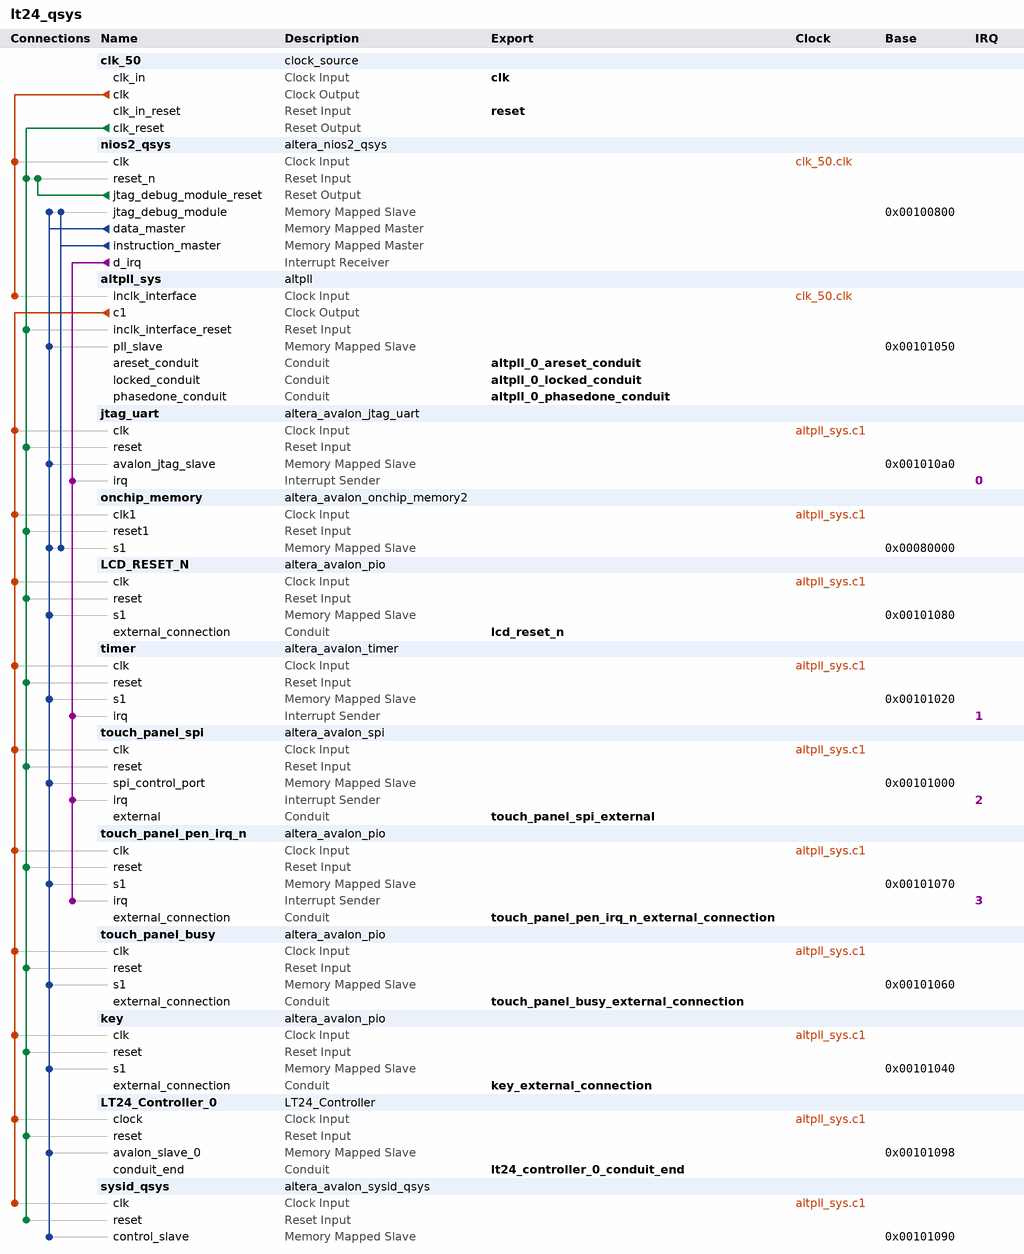
[diagram p0: system contents]
# Platform Designer (Qsys) system lt24_qsys, Cyclone IV E EP4CE115F29C7
# Parameters at their usual value, and those the tool derives, are not listed.
package require -exact qsys 13.1
create_system lt24_qsys
set_project_property DEVICE_FAMILY {Cyclone IV E}
set_project_property DEVICE EP4CE115F29C7

add_instance clk_50 clock_source 13.1
set_instance_parameter_value clk_50 clockFrequency 50000000

add_instance nios2_qsys altera_nios2_qsys 13.1
set_instance_parameter_value nios2_qsys resetSlave onchip_memory.s1
set_instance_parameter_value nios2_qsys exceptionSlave onchip_memory.s1
set_instance_parameter_value nios2_qsys breakSlave nios2_qsys.jtag_debug_module
set_instance_parameter_value nios2_qsys impl Fast
set_instance_parameter_value nios2_qsys icache_size 4096

add_instance altpll_sys altpll 13.1
set_instance_parameter_value altpll_sys INCLK0_INPUT_FREQUENCY 20000
set_instance_parameter_value altpll_sys CLK0_MULTIPLY_BY 2
set_instance_parameter_value altpll_sys CLK1_MULTIPLY_BY 3
set_instance_parameter_value altpll_sys CLK0_DIVIDE_BY 1
set_instance_parameter_value altpll_sys CLK1_DIVIDE_BY 1
set_instance_parameter_value altpll_sys CLK1_PHASE_SHIFT 0
set_instance_parameter_value altpll_sys CLK1_DUTY_CYCLE 50
set_instance_parameter_value altpll_sys PORT_clk1 PORT_USED
set_instance_parameter_value altpll_sys PORT_clk2 PORT_UNUSED
set_instance_parameter_value altpll_sys PORT_clk3 PORT_UNUSED
set_instance_parameter_value altpll_sys PORT_ARESET PORT_UNUSED
set_instance_parameter_value altpll_sys PORT_LOCKED PORT_UNUSED

add_instance jtag_uart altera_avalon_jtag_uart 13.1
set_instance_parameter_value jtag_uart simInteractiveOptions INTERACTIVE_ASCII_OUTPUT

add_instance onchip_memory altera_avalon_onchip_memory2 13.1
set_instance_parameter_value onchip_memory dataWidth 32
set_instance_parameter_value onchip_memory dualPort false
set_instance_parameter_value onchip_memory initMemContent true
set_instance_parameter_value onchip_memory initializationFileName onchip_memory
set_instance_parameter_value onchip_memory memorySize 280000

add_instance LCD_RESET_N altera_avalon_pio 13.1
set_instance_parameter_value LCD_RESET_N direction Output
set_instance_parameter_value LCD_RESET_N width 1

add_instance timer altera_avalon_timer 13.1
set_instance_parameter_value timer period 1
set_instance_parameter_value timer periodUnits MSEC

add_instance touch_panel_spi altera_avalon_spi 13.1
set_instance_parameter_value touch_panel_spi clockPolarity 0
set_instance_parameter_value touch_panel_spi dataWidth 8
set_instance_parameter_value touch_panel_spi masterSPI true
set_instance_parameter_value touch_panel_spi numberOfSlaves 1
set_instance_parameter_value touch_panel_spi targetClockRate 32000

add_instance touch_panel_pen_irq_n altera_avalon_pio 13.1
set_instance_parameter_value touch_panel_pen_irq_n captureEdge true
set_instance_parameter_value touch_panel_pen_irq_n direction Input
set_instance_parameter_value touch_panel_pen_irq_n edgeType FALLING
set_instance_parameter_value touch_panel_pen_irq_n generateIRQ true
set_instance_parameter_value touch_panel_pen_irq_n irqType EDGE
set_instance_parameter_value touch_panel_pen_irq_n width 1

add_instance touch_panel_busy altera_avalon_pio 13.1
set_instance_parameter_value touch_panel_busy direction Input
set_instance_parameter_value touch_panel_busy width 1

add_instance key altera_avalon_pio 13.1
set_instance_parameter_value key direction Input
set_instance_parameter_value key width 4

add_instance LT24_Controller_0 LT24_Controller 1.0

add_instance sysid_qsys altera_avalon_sysid_qsys 13.1
set_instance_parameter_value sysid_qsys id 0

# connections
add_connection altpll_sys.c1 jtag_uart.clk clock
add_connection altpll_sys.c1 key.clk clock
add_connection altpll_sys.c1 LCD_RESET_N.clk clock
add_connection altpll_sys.c1 LT24_Controller_0.clock clock
add_connection altpll_sys.c1 onchip_memory.clk1 clock
add_connection altpll_sys.c1 sysid_qsys.clk clock
add_connection altpll_sys.c1 timer.clk clock
add_connection altpll_sys.c1 touch_panel_busy.clk clock
add_connection altpll_sys.c1 touch_panel_pen_irq_n.clk clock
add_connection altpll_sys.c1 touch_panel_spi.clk clock
add_connection clk_50.clk altpll_sys.inclk_interface clock
add_connection clk_50.clk nios2_qsys.clk clock
add_connection clk_50.clk_reset altpll_sys.inclk_interface_reset reset
add_connection clk_50.clk_reset jtag_uart.reset reset
add_connection clk_50.clk_reset key.reset reset
add_connection clk_50.clk_reset LCD_RESET_N.reset reset
add_connection clk_50.clk_reset LT24_Controller_0.reset reset
add_connection clk_50.clk_reset nios2_qsys.reset_n reset
add_connection clk_50.clk_reset onchip_memory.reset1 reset
add_connection clk_50.clk_reset sysid_qsys.reset reset
add_connection clk_50.clk_reset timer.reset reset
add_connection clk_50.clk_reset touch_panel_busy.reset reset
add_connection clk_50.clk_reset touch_panel_pen_irq_n.reset reset
add_connection clk_50.clk_reset touch_panel_spi.reset reset
add_connection nios2_qsys.jtag_debug_module_reset nios2_qsys.reset_n reset
add_connection nios2_qsys.data_master altpll_sys.pll_slave avalon
set_connection_parameter_value nios2_qsys.data_master/altpll_sys.pll_slave baseAddress 0x00101050
add_connection nios2_qsys.data_master jtag_uart.avalon_jtag_slave avalon
set_connection_parameter_value nios2_qsys.data_master/jtag_uart.avalon_jtag_slave baseAddress 0x001010a0
add_connection nios2_qsys.data_master key.s1 avalon
set_connection_parameter_value nios2_qsys.data_master/key.s1 baseAddress 0x00101040
add_connection nios2_qsys.data_master LCD_RESET_N.s1 avalon
set_connection_parameter_value nios2_qsys.data_master/LCD_RESET_N.s1 baseAddress 0x00101080
add_connection nios2_qsys.data_master LT24_Controller_0.avalon_slave_0 avalon
set_connection_parameter_value nios2_qsys.data_master/LT24_Controller_0.avalon_slave_0 baseAddress 0x00101098
add_connection nios2_qsys.data_master nios2_qsys.jtag_debug_module avalon
set_connection_parameter_value nios2_qsys.data_master/nios2_qsys.jtag_debug_module baseAddress 0x00100800
add_connection nios2_qsys.data_master onchip_memory.s1 avalon
set_connection_parameter_value nios2_qsys.data_master/onchip_memory.s1 baseAddress 0x00080000
add_connection nios2_qsys.data_master sysid_qsys.control_slave avalon
set_connection_parameter_value nios2_qsys.data_master/sysid_qsys.control_slave baseAddress 0x00101090
add_connection nios2_qsys.data_master timer.s1 avalon
set_connection_parameter_value nios2_qsys.data_master/timer.s1 baseAddress 0x00101020
add_connection nios2_qsys.data_master touch_panel_busy.s1 avalon
set_connection_parameter_value nios2_qsys.data_master/touch_panel_busy.s1 baseAddress 0x00101060
add_connection nios2_qsys.data_master touch_panel_pen_irq_n.s1 avalon
set_connection_parameter_value nios2_qsys.data_master/touch_panel_pen_irq_n.s1 baseAddress 0x00101070
add_connection nios2_qsys.data_master touch_panel_spi.spi_control_port avalon
set_connection_parameter_value nios2_qsys.data_master/touch_panel_spi.spi_control_port baseAddress 0x00101000
add_connection nios2_qsys.instruction_master nios2_qsys.jtag_debug_module avalon
set_connection_parameter_value nios2_qsys.instruction_master/nios2_qsys.jtag_debug_module baseAddress 0x00100800
add_connection nios2_qsys.instruction_master onchip_memory.s1 avalon
set_connection_parameter_value nios2_qsys.instruction_master/onchip_memory.s1 baseAddress 0x00080000
add_connection nios2_qsys.d_irq jtag_uart.irq interrupt
set_connection_parameter_value nios2_qsys.d_irq/jtag_uart.irq irqNumber 0
add_connection nios2_qsys.d_irq timer.irq interrupt
set_connection_parameter_value nios2_qsys.d_irq/timer.irq irqNumber 1
add_connection nios2_qsys.d_irq touch_panel_pen_irq_n.irq interrupt
set_connection_parameter_value nios2_qsys.d_irq/touch_panel_pen_irq_n.irq irqNumber 3
add_connection nios2_qsys.d_irq touch_panel_spi.irq interrupt
set_connection_parameter_value nios2_qsys.d_irq/touch_panel_spi.irq irqNumber 2

# exported interfaces
add_interface clk clock sink
set_interface_property clk EXPORT_OF clk_50.clk_in
add_interface reset reset sink
set_interface_property reset EXPORT_OF clk_50.clk_in_reset
add_interface lcd_reset_n conduit end
set_interface_property lcd_reset_n EXPORT_OF LCD_RESET_N.external_connection
add_interface touch_panel_pen_irq_n_external_connection conduit end
set_interface_property touch_panel_pen_irq_n_external_connection EXPORT_OF touch_panel_pen_irq_n.external_connection
add_interface touch_panel_busy_external_connection conduit end
set_interface_property touch_panel_busy_external_connection EXPORT_OF touch_panel_busy.external_connection
add_interface touch_panel_spi_external conduit end
set_interface_property touch_panel_spi_external EXPORT_OF touch_panel_spi.external
add_interface altpll_0_areset_conduit conduit end
set_interface_property altpll_0_areset_conduit EXPORT_OF altpll_sys.areset_conduit
add_interface altpll_0_locked_conduit conduit end
set_interface_property altpll_0_locked_conduit EXPORT_OF altpll_sys.locked_conduit
add_interface altpll_0_phasedone_conduit conduit end
set_interface_property altpll_0_phasedone_conduit EXPORT_OF altpll_sys.phasedone_conduit
add_interface key_external_connection conduit end
set_interface_property key_external_connection EXPORT_OF key.external_connection
add_interface lt24_controller_0_conduit_end conduit end
set_interface_property lt24_controller_0_conduit_end EXPORT_OF LT24_Controller_0.conduit_end

set_interconnect_requirement {$system} qsys_mm.clockCrossingAdapter HANDSHAKE
set_interconnect_requirement {$system} qsys_mm.maxAdditionalLatency 1

save_system lt24_qsys.qsys
